# EAGLE schematic ZORRO-LAN-IDE-CP (EAGLE 6.6.0)

## Sheet 1 of 3
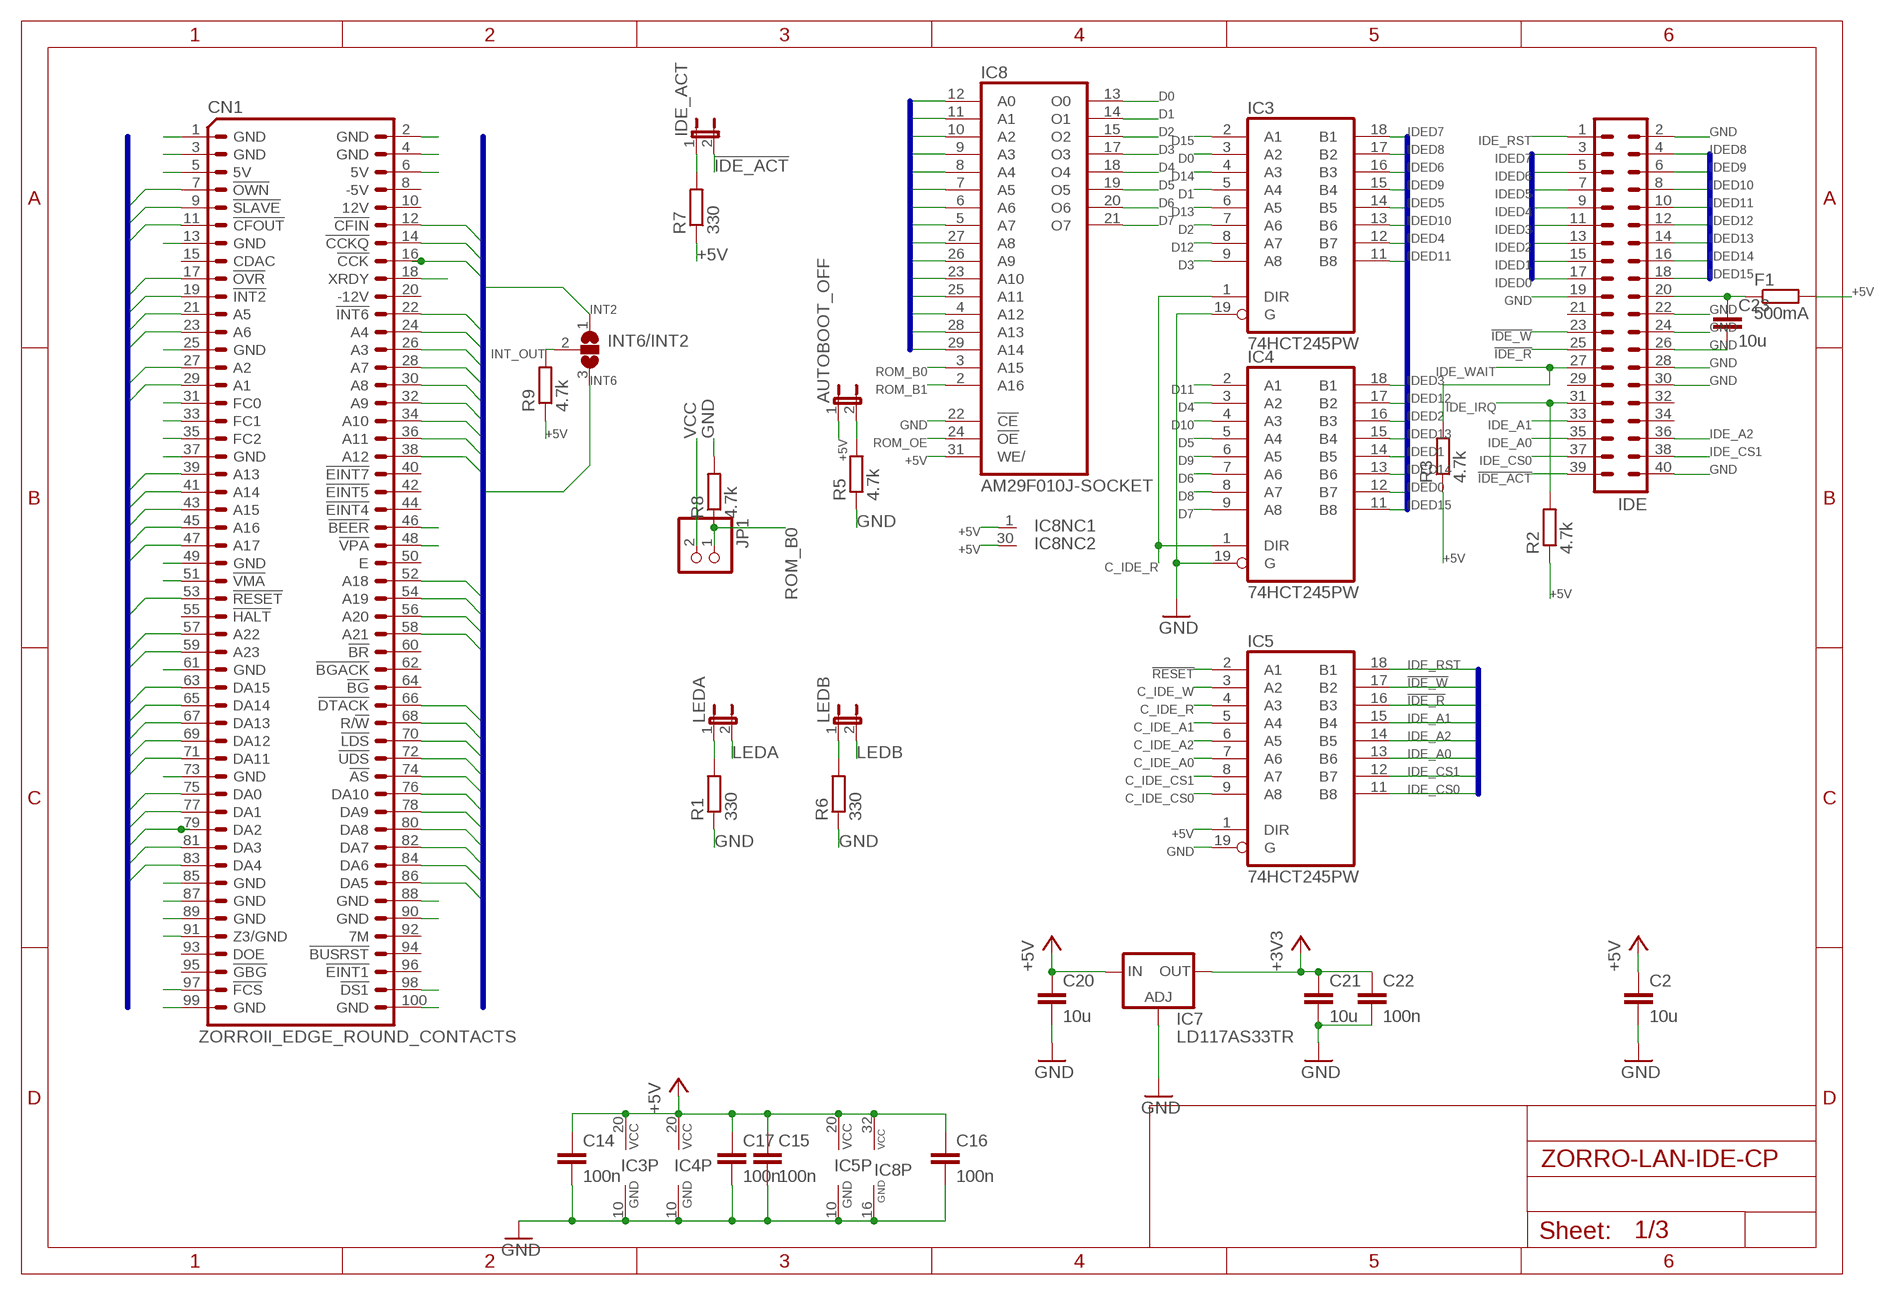
[diagram p0: schematic, sheet 1]

### Parts
AUTOBOOT_OFF  JP1E  [JP1]
C2  10u  C-EUC0805K  [C0805K]
C14  100n  C-EUC0603K  [C0603K]
C15  100n  C-EUC0603K  [C0603K]
C16  100n  C-EUC0603K  [C0603K]
C17  100n  C-EUC0603K  [C0603K]
C20  10u  C-EUC0805K  [C0805K]
C21  10u  C-EUC0805K  [C0805K]
C22  100n  C-EUC0603K  [C0603K]
C23  10u  C-EUC0805K  [C0805K]
CN1  ZORROII_EDGE_ROUND_CONTACTS  [LKONT_50_R]
F1  500mA  R-EU_R2512  [R2512]
IC3  74HCT245PW  [TSSOP20]
IC4  74HCT245PW  [TSSOP20]
IC5  74HCT245PW  [TSSOP20]
IC7  LD117AS33TR  [SOT223]
IC8  AM29F010J-SOCKET  [PLCC-32-SMT-TT]
IDE  ML40  [ML40]
IDE_ACT  JP1E  [JP1]
INT6/INT2  SJ2W  [SJ_2]
JP1  PINHD-1X02_2.54-S  [1X02-S]
LEDA  JP1E  [JP1]
LEDB  JP1E  [JP1]
R1  330  R-EU_R0603  [R0603]
R2  4.7k  R-EU_R0603  [R0603]
R3  4.7k  R-EU_R0603  [R0603]
R5  4.7k  R-EU_R0603  [R0603]
R6  330  R-EU_R0603  [R0603]
R7  330  R-EU_R0603  [R0603]
R8  4.7k  R-EU_R0603  [R0603]
R9  4.7k  R-EU_R0603  [R0603]

### Nets
!AS: CN1.74(!AS!) ; also sheet 2
!BERR: CN1.46(!BEER!) ; also sheet 2
!CFIN: CN1.12(!CFIN!) ; also sheet 2
!CFOUT: CN1.11(!CFOUT!) ; also sheet 2
!DS0: CN1.51(!VMA!) ; also sheet 2
!DS1: CN1.98(!DS1!) ; also sheet 2
!DTACK: CN1.66(!DTACK!) ; also sheet 2
!FCS: CN1.97(!FCS!) ; also sheet 2
!IDE_ACT: IDE.39 IDE_ACT.2
!IDE_R: IC5.16(B3) IDE.25
!IDE_W: IC5.17(B2) IDE.23
!LDS: CN1.70(!LDS!) ; also sheet 2
!MTACK: CN1.48(!VPA!) ; also sheet 2
!MTCR: CN1.18(XRDY) ; also sheet 2
!OVR: CN1.17(!OVR!) ; also sheet 2
!OWN: CN1.7(!OWN!) ; also sheet 2
!RESET: CN1.53(!RESET!) IC5.2(A1) ; also sheet 2
!SLAVE: CN1.9(!SLAVE!) ; also sheet 2
!UDS: CN1.72(!UDS!) ; also sheet 2
+3V3: C21.1 C22.1 IC7.2(OUT) IC7.4(OUT) ; also sheet 2
+5V: AUTOBOOT_OFF.1 C2.1 C14.1 C15.1 C16.1 C17.1 C20.1 CN1.5(5V) CN1.6(5V) F1.2 IC3.20(VCC) IC4.20(VCC) IC5.1(DIR) IC5.20(VCC) IC7.3(IN) IC8.1(NC) IC8.30(NC) IC8.31(WE/) IC8.32(VCC) R2.1 R3.1 R7.1 R9.1 ; also sheet 2,3
A1: CN1.29(A1) IC8.12(A0) ; also sheet 2
A2: CN1.27(A2) IC8.11(A1) ; also sheet 2
A3: CN1.26(A3) IC8.10(A2) ; also sheet 2
A4: CN1.24(A4) IC8.9(A3) ; also sheet 2
A5: CN1.21(A5) IC8.8(A4) ; also sheet 2
A6: CN1.23(A6) IC8.7(A5) ; also sheet 2
A7: CN1.28(A7) IC8.6(A6) ; also sheet 2
A8: CN1.30(A8) IC8.5(A7) ; also sheet 2
A9: CN1.32(A9) IC8.27(A8) ; also sheet 2
A10: CN1.34(A10) IC8.26(A9) ; also sheet 2
A11: CN1.36(A11) IC8.23(A10) ; also sheet 2
A12: CN1.38(A12) IC8.25(A11) ; also sheet 2
A13: CN1.39(A13) IC8.4(A12) ; also sheet 2
A14: CN1.41(A14) IC8.28(A13) ; also sheet 2
A15: CN1.43(A15) IC8.29(A14) ; also sheet 2
A16: CN1.45(A16) ; also sheet 2
A17: CN1.47(A17) ; also sheet 2
A18: CN1.52(A18) ; also sheet 2
A19: CN1.54(A19) ; also sheet 2
A20: CN1.56(A20) ; also sheet 2
A21: CN1.58(A21) ; also sheet 2
A22: CN1.57(A22) ; also sheet 2
A23: CN1.59(A23) ; also sheet 2
AUTO_BOOT_OFF: AUTOBOOT_OFF.2 R5.2 ; also sheet 2
C1: CN1.14(!CCKQ!) ; also sheet 2
C3: CN1.16(!CCK!) ; also sheet 2
C_IDE_A0: IC5.7(A6) ; also sheet 2
C_IDE_A1: IC5.5(A4) ; also sheet 2
C_IDE_A2: IC5.6(A5) ; also sheet 2
C_IDE_CS0: IC5.9(A8) ; also sheet 2
C_IDE_CS1: IC5.8(A7) ; also sheet 2
C_IDE_R: IC3.1(DIR) IC4.1(DIR) IC5.4(A3) ; also sheet 2
C_IDE_W: IC5.3(A2) ; also sheet 2
D0: CN1.75(DA0) IC3.3(A2) IC8.13(O0) ; also sheet 2
D1: CN1.77(DA1) IC3.5(A4) IC8.14(O1) ; also sheet 2
D2: CN1.79(DA2) IC3.7(A6) IC8.15(O2) ; also sheet 2
D3: CN1.81(DA3) IC3.9(A8) IC8.17(O3) ; also sheet 2
D4: CN1.83(DA4) IC4.3(A2) IC8.18(O4) ; also sheet 2
D5: CN1.86(DA5) IC4.5(A4) IC8.19(O5) ; also sheet 2
D6: CN1.84(DA6) IC4.7(A6) IC8.20(O6) ; also sheet 2
D7: CN1.82(DA7) IC4.9(A8) IC8.21(O7) ; also sheet 2
D8: CN1.80(DA8) IC4.8(A7) ; also sheet 2
D9: CN1.78(DA9) IC4.6(A5) ; also sheet 2
D10: CN1.76(DA10) IC4.4(A3) ; also sheet 2
D11: CN1.71(DA11) IC4.2(A1) ; also sheet 2
D12: CN1.69(DA12) IC3.8(A7) ; also sheet 2
D13: CN1.67(DA13) IC3.6(A5) ; also sheet 2
D14: CN1.65(DA14) IC3.4(A3) ; also sheet 2
D15: CN1.63(DA15) IC3.2(A1) ; also sheet 2
FC0: CN1.31(FC0)
FC1: CN1.33(FC1)
FC2: CN1.35(FC2)
GND: C2.2 C14.2 C15.2 C16.2 C17.2 C20.2 C21.2 C22.2 C23.2 CN1.1(GND) CN1.2(GND) CN1.3(GND) CN1.4(GND) CN1.13(GND) CN1.25(GND) CN1.37(GND) CN1.49(GND) CN1.61(GND) CN1.73(GND) CN1.85(GND) CN1.87(GND) CN1.88(GND) CN1.89(GND) CN1.90(GND) CN1.99(GND) CN1.100(GND) IC3.10(GND) IC3.19(G) IC4.10(GND) IC4.19(G) IC5.10(GND) IC5.19(G) IC7.1(ADJ) IC8.16(GND) IC8.22(!CE) IDE.2 IDE.19 IDE.22 IDE.24 IDE.26 IDE.28 IDE.30 IDE.40 R1.1 R5.1 R6.1 R8.2 ; also sheet 2,3
IDE_A0: IC5.13(B6) IDE.35
IDE_A1: IC5.15(B4) IDE.33
IDE_A2: IC5.14(B5) IDE.36
IDE_CS0: IC5.11(B8) IDE.37
IDE_CS1: IC5.12(B7) IDE.38
IDE_IRQ: IDE.31 R2.2
IDE_RST: IC5.18(B1) IDE.1 ; also sheet 3
IDE_WAIT: IDE.27 R3.2 ; also sheet 2
IDED0: IC4.12(B7) IDE.17
IDED1: IC4.14(B5) IDE.15
IDED2: IC4.16(B3) IDE.13
IDED3: IC4.18(B1) IDE.11
IDED4: IC3.12(B7) IDE.9
IDED5: IC3.14(B5) IDE.7
IDED6: IC3.16(B3) IDE.5
IDED7: IC3.18(B1) IDE.3
IDED8: IC3.17(B2) IDE.4
IDED9: IC3.15(B4) IDE.6
IDED10: IC3.13(B6) IDE.8
IDED11: IC3.11(B8) IDE.10
IDED12: IC4.17(B2) IDE.12
IDED13: IC4.15(B4) IDE.14
IDED14: IC4.13(B6) IDE.16
IDED15: IC4.11(B8) IDE.18
INT2: CN1.19(!INT2!) INT6/INT2.1
INT6: CN1.22(!INT6!) INT6/INT2.3
INT_OUT: INT6/INT2.2 R9.2 ; also sheet 2
KEY_PIN_POWER: C23.1 F1.1 IDE.20
LEDA: LEDA.2 ; also sheet 2
LEDB: LEDB.2 ; also sheet 2
N$1: LEDA.1 R1.2
N$2: LEDB.1 R6.2
N$42: IDE_ACT.1 R7.2
R/W: CN1.68(R/!W!) ; also sheet 2
ROM_B0: IC8.3(A15) JP1.1 R8.1 ; also sheet 2
ROM_B1: IC8.2(A16) ; also sheet 2
ROM_OE: IC8.24(!OE) ; also sheet 2
VCC: JP1.2
Z3: CN1.91(Z3/GND) ; also sheet 2
Unconnected: CN1.8(-5V) CN1.10(12V) CN1.15(CDAC) CN1.20(-12V) CN1.40(!EINT7!) CN1.42(!EINT5!) CN1.44(!EINT4!) CN1.50(E) CN1.55(!HALT!) CN1.60(!BR!) CN1.62(!BGACK!) CN1.64(!BG!) CN1.92(7M) CN1.93(DOE) CN1.94(!BUSRST!) CN1.95(!GBG!) CN1.96(!EINT1!) IDE.21 IDE.29 IDE.32 IDE.34

### Buses
IDED[0..15]
IDE_RST,IDE_A[0..2],IDE_CS[0..1],!IDE_R,!IDE_W
A[1..23]
A[1..31],D[0..15],C1,C3,!UDS,!LDS,!RESET,!AS,!DTACK,R/W,!OWN,!SLAVE,!CFIN,!CFOUT,!OVR,INT2,INT6
A[1..23],D[0..15],C1,C3,!UDS,!LDS,!RESET,!AS,!DTACK,R/W,!OWN,!SLAVE,!CFIN,!CFOUT,!OVR,INT2,INT6

## Sheet 2 of 3
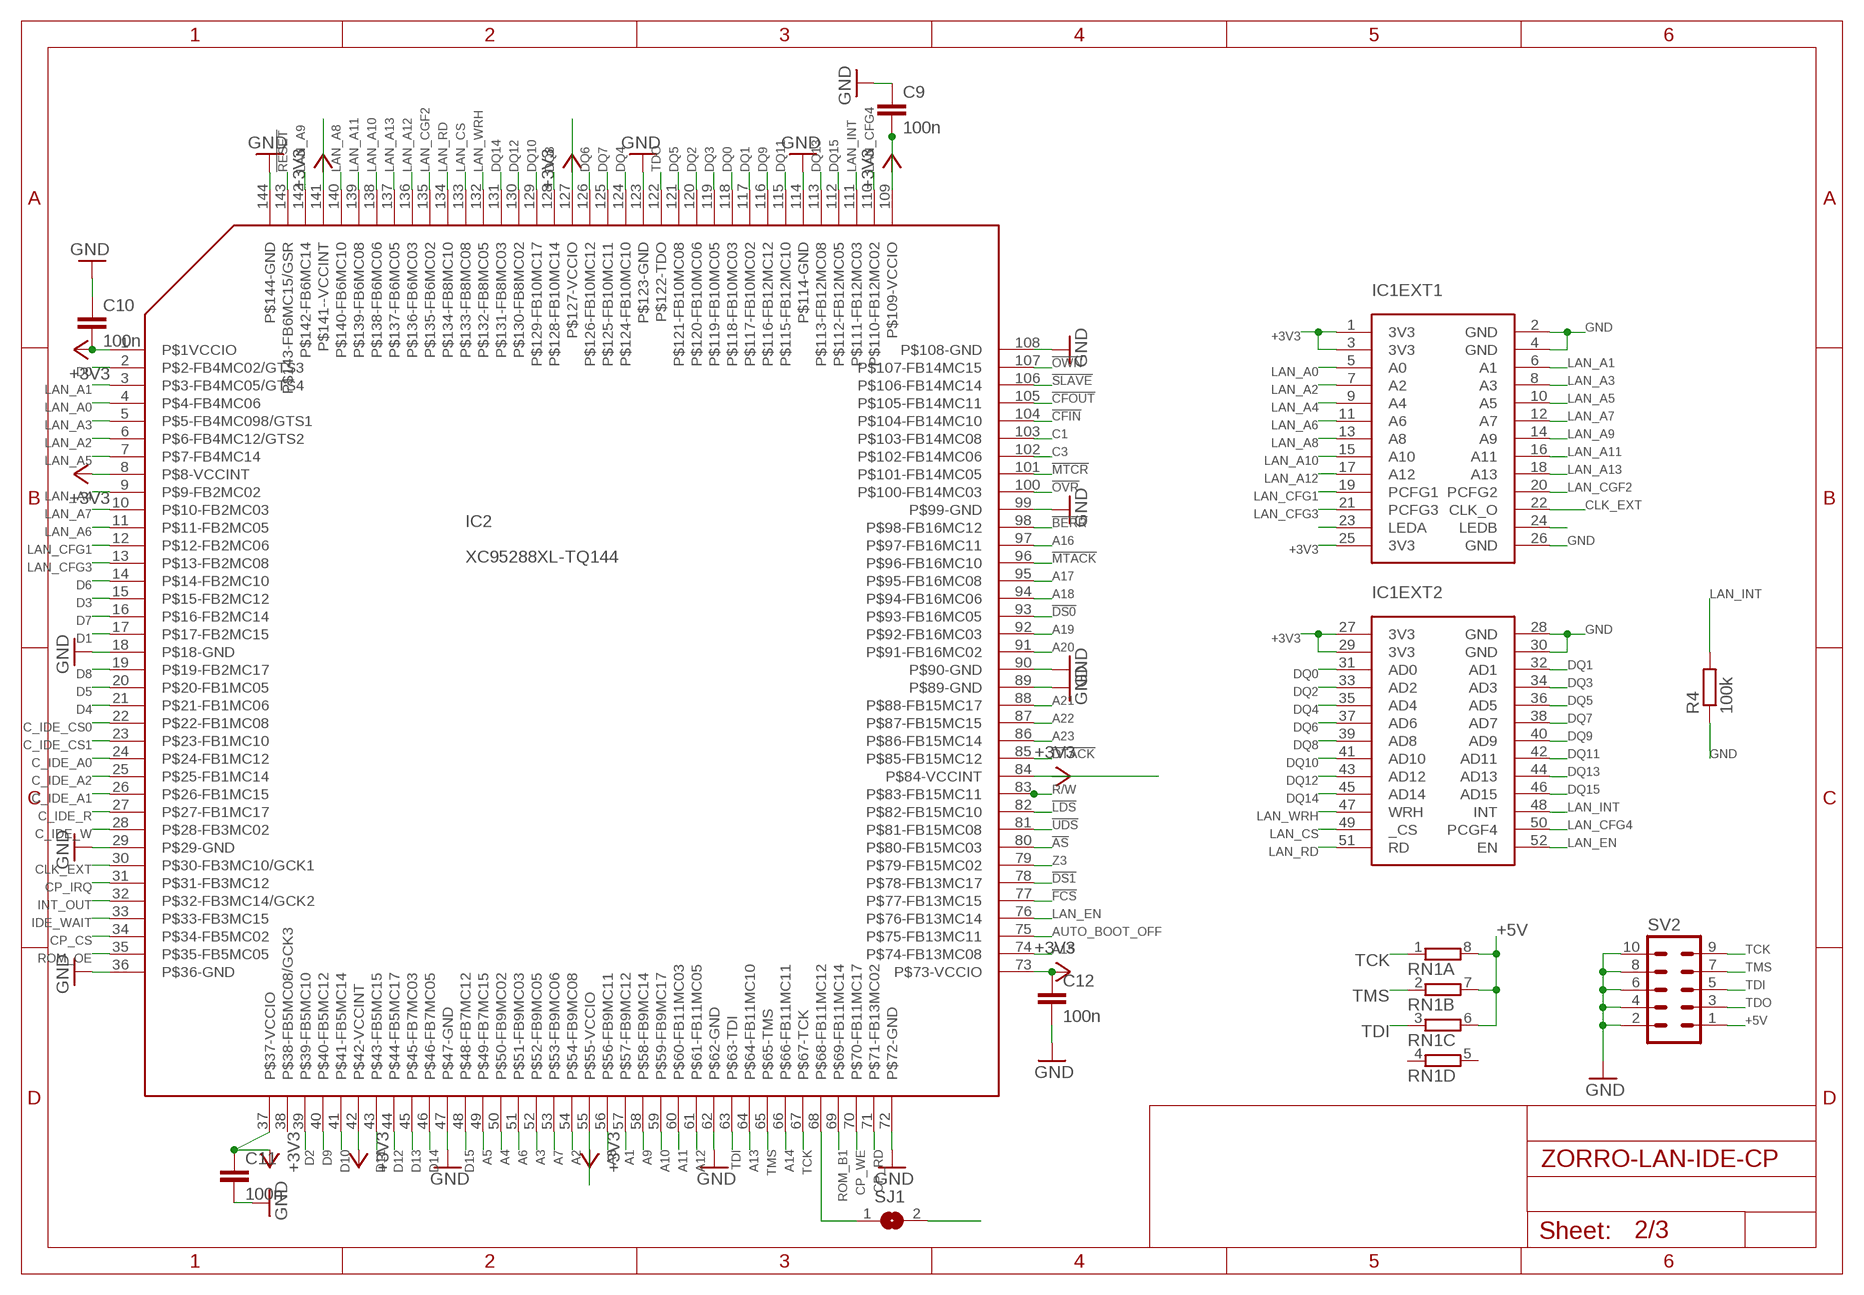
[diagram p1: schematic, sheet 2]

### Parts
C9  100n  C-EUC0603K  [C0603K]
C10  100n  C-EUC0603K  [C0603K]
C11  100n  C-EUC0603K  [C0603K]
C12  100n  C-EUC0603K  [C0603K]
IC1  OLIMEX_ENC  [OLIMEX-ENC624J600]
IC2  XC95288XL-TQ144  [TQFP144]
R4  100k  R-EU_R0603  [R0603]
RN1  4R-NCAY16  [CAY16]
SJ1  SJ  [SJ]
SV2  ML10L  [ML10L]

### Nets
!AS: IC2.80(P$80-FB15MC03) ; also sheet 1
!BERR: IC2.98(P$98-FB16MC12) ; also sheet 1
!CFIN: IC2.104(P$104-FB14MC10) ; also sheet 1
!CFOUT: IC2.105(P$105-FB14MC11) ; also sheet 1
!DS0: IC2.93(P$93-FB16MC05) ; also sheet 1
!DS1: IC2.78(P$78-FB13MC17) ; also sheet 1
!DTACK: IC2.85(P$85-FB15MC12) ; also sheet 1
!FCS: IC2.77(P$77-FB13MC15) ; also sheet 1
!LDS: IC2.82(P$82-FB15MC10) ; also sheet 1
!MTACK: IC2.96(P$96-FB16MC10) ; also sheet 1
!MTCR: IC2.101(P$101-FB14MC05) ; also sheet 1
!OVR: IC2.100(P$100-FB14MC03) ; also sheet 1
!OWN: IC2.107(P$107-FB14MC15) ; also sheet 1
!RESET: IC2.143(P$143-FB6MC15/GSR) ; also sheet 1
!SLAVE: IC2.106(P$106-FB14MC14) ; also sheet 1
!UDS: IC2.81(P$81-FB15MC08) ; also sheet 1
+3V3: C9.2 C10.2 C11.1 C12.1 IC1.1(EXT1:3V3) IC1.3(EXT1:3V3) IC1.25(EXT1:3V3) IC1.27(EXT2:3V3) IC1.29(EXT2:3V3) IC2.1(P$1VCCIO) IC2.8(P$8-VCCINT) IC2.37(P$37-VCCIO) IC2.42(P$42-VCCINT) IC2.55(P$55-VCCIO) IC2.73(P$73-VCCIO) IC2.84(P$84-VCCINT) IC2.109(P$109-VCCIO) IC2.127(P$127-VCCIO) IC2.141(P$141--VCCINT) ; also sheet 1
+5V: RN1.6 RN1.7 RN1.8 SV2.1 ; also sheet 1,3
A1: IC2.57(P$57-FB9MC12) ; also sheet 1
A2: IC2.54(P$54-FB9MC08) ; also sheet 1
A3: IC2.52(P$52-FB9MC05) ; also sheet 1
A4: IC2.50(P$50-FB9MC02) ; also sheet 1
A5: IC2.49(P$49-FB7MC15) ; also sheet 1
A6: IC2.51(P$51-FB9MC03) ; also sheet 1
A7: IC2.53(P$53-FB9MC06) ; also sheet 1
A8: IC2.56(P$56-FB9MC11) ; also sheet 1
A9: IC2.58(P$58-FB9MC14) ; also sheet 1
A10: IC2.59(P$59-FB9MC17) ; also sheet 1
A11: IC2.60(P$60-FB11MC03) ; also sheet 1
A12: IC2.61(P$61-FB11MC05) ; also sheet 1
A13: IC2.64(P$64-FB11MC10) ; also sheet 1
A14: IC2.66(P$66-FB11MC11) ; also sheet 1
A15: IC2.74(P$74-FB13MC08) ; also sheet 1
A16: IC2.97(P$97-FB16MC11) ; also sheet 1
A17: IC2.95(P$95-FB16MC08) ; also sheet 1
A18: IC2.94(P$94-FB16MC06) ; also sheet 1
A19: IC2.92(P$92-FB16MC03) ; also sheet 1
A20: IC2.91(P$91-FB16MC02) ; also sheet 1
A21: IC2.88(P$88-FB15MC17) ; also sheet 1
A22: IC2.87(P$87-FB15MC15) ; also sheet 1
A23: IC2.86(P$86-FB15MC14) ; also sheet 1
AUTO_BOOT_OFF: IC2.75(P$75-FB13MC11) ; also sheet 1
C1: IC2.103(P$103-FB14MC08) ; also sheet 1
C3: IC2.102(P$102-FB14MC06) ; also sheet 1
C_IDE_A0: IC2.24(P$24-FB1MC12) ; also sheet 1
C_IDE_A1: IC2.26(P$26-FB1MC15) ; also sheet 1
C_IDE_A2: IC2.25(P$25-FB1MC14) ; also sheet 1
C_IDE_CS0: IC2.22(P$22-FB1MC08) ; also sheet 1
C_IDE_CS1: IC2.23(P$23-FB1MC10) ; also sheet 1
C_IDE_R: IC2.27(P$27-FB1MC17) ; also sheet 1
C_IDE_W: IC2.28(P$28-FB3MC02) ; also sheet 1
CLK_EXT: IC1.22(EXT1:CLK_O) IC2.30(P$30-FB3MC10/GCK1)
CP_CS: IC2.34(P$34-FB5MC02) ; also sheet 3
CP_IRQ: IC2.31(P$31-FB3MC12) ; also sheet 3
CP_RD: IC2.71(P$71-FB13MC02) ; also sheet 3
CP_WE: IC2.70(P$70-FB11MC17) ; also sheet 3
D0: IC2.2(P$2-FB4MC02/GTS3) ; also sheet 1
D1: IC2.17(P$17-FB2MC15) ; also sheet 1
D2: IC2.39(P$39-FB5MC10) ; also sheet 1
D3: IC2.15(P$15-FB2MC12) ; also sheet 1
D4: IC2.21(P$21-FB1MC06) ; also sheet 1
D5: IC2.20(P$20-FB1MC05) ; also sheet 1
D6: IC2.14(P$14-FB2MC10) ; also sheet 1
D7: IC2.16(P$16-FB2MC14) ; also sheet 1
D8: IC2.19(P$19-FB2MC17) ; also sheet 1
D9: IC2.40(P$40-FB5MC12) ; also sheet 1
D10: IC2.41(P$41-FB5MC14) ; also sheet 1
D11: IC2.43(P$43-FB5MC15) ; also sheet 1
D12: IC2.44(P$44-FB5MC17) ; also sheet 1
D13: IC2.45(P$45-FB7MC03) ; also sheet 1
D14: IC2.46(P$46-FB7MC05) ; also sheet 1
D15: IC2.48(P$48-FB7MC12) ; also sheet 1
DQ0: IC1.31(EXT2:AD0) IC2.118(P$118-FB10MC03) ; also sheet 3
DQ1: IC1.32(EXT2:AD1) IC2.117(P$117-FB10MC02) ; also sheet 3
DQ2: IC1.33(EXT2:AD2) IC2.120(P$120-FB10MC06) ; also sheet 3
DQ3: IC1.34(EXT2:AD3) IC2.119(P$119-FB10MC05) ; also sheet 3
DQ4: IC1.35(EXT2:AD4) IC2.124(P$124-FB10MC10) ; also sheet 3
DQ5: IC1.36(EXT2:AD5) IC2.121(P$121-FB10MC08) ; also sheet 3
DQ6: IC1.37(EXT2:AD6) IC2.126(P$126-FB10MC12) ; also sheet 3
DQ7: IC1.38(EXT2:AD7) IC2.125(P$125-FB10MC11) ; also sheet 3
DQ8: IC1.39(EXT2:AD8) IC2.128(P$128-FB10MC14)
DQ9: IC1.40(EXT2:AD9) IC2.116(P$116-FB12MC12)
DQ10: IC1.41(EXT2:AD10) IC2.129(P$129-FB10MC17)
DQ11: IC1.42(EXT2:AD11) IC2.115(P$115-FB12MC10)
DQ12: IC1.43(EXT2:AD12) IC2.130(P$130-FB8MC02)
DQ13: IC1.44(EXT2:AD13) IC2.113(P$113-FB12MC08)
DQ14: IC1.45(EXT2:AD14) IC2.131(P$131-FB8MC03)
DQ15: IC1.46(EXT2:AD15) IC2.112(P$112-FB12MC05)
GND: C9.1 C10.1 C11.2 C12.2 IC1.2(EXT1:GND) IC1.4(EXT1:GND) IC1.26(EXT1:GND) IC1.28(EXT2:GND) IC1.30(EXT2:GND) IC2.18(P$18-GND) IC2.29(P$29-GND) IC2.36(P$36-GND) IC2.47(P$47-GND) IC2.62(P$62-GND) IC2.72(P$72-GND) IC2.89(P$89-GND) IC2.90(P$90-GND) IC2.99(P$99-GND) IC2.108(P$108-GND) IC2.114(P$114-GND) IC2.123(P$123-GND) IC2.144(P$144-GND) R4.1 SV2.2 SV2.4 SV2.6 SV2.8 SV2.10 ; also sheet 1,3
IDE_WAIT: IC2.33(P$33-FB3MC15) ; also sheet 1
INT_OUT: IC2.32(P$32-FB3MC14/GCK2) ; also sheet 1
LAN_A0: IC1.5(EXT1:A0) IC2.4(P$4-FB4MC06)
LAN_A1: IC1.6(EXT1:A1) IC2.3(P$3-FB4MC05/GTS4)
LAN_A2: IC1.7(EXT1:A2) IC2.6(P$6-FB4MC12/GTS2) ; also sheet 3
LAN_A3: IC1.8(EXT1:A3) IC2.5(P$5-FB4MC098/GTS1) ; also sheet 3
LAN_A4: IC1.9(EXT1:A4) IC2.9(P$9-FB2MC02) ; also sheet 3
LAN_A5: IC1.10(EXT1:A5) IC2.7(P$7-FB4MC14) ; also sheet 3
LAN_A6: IC1.11(EXT1:A6) IC2.11(P$11-FB2MC05)
LAN_A7: IC1.12(EXT1:A7) IC2.10(P$10-FB2MC03)
LAN_A8: IC1.13(EXT1:A8) IC2.140(P$140-FB6MC10)
LAN_A9: IC1.14(EXT1:A9) IC2.142(P$142-FB6MC14)
LAN_A10: IC1.15(EXT1:A10) IC2.138(P$138-FB6MC06)
LAN_A11: IC1.16(EXT1:A11) IC2.139(P$139-FB6MC08)
LAN_A12: IC1.17(EXT1:A12) IC2.136(P$136-FB6MC03)
LAN_A13: IC1.18(EXT1:A13) IC2.137(P$137-FB6MC05)
LAN_CFG1: IC1.19(EXT1:PCFG1) IC2.12(P$12-FB2MC06)
LAN_CFG3: IC1.21(EXT1:PCFG3) IC2.13(P$13-FB2MC08)
LAN_CFG4: IC1.50(EXT2:PCGF4) IC2.110(P$110-FB12MC02)
LAN_CGF2: IC1.20(EXT1:PCFG2) IC2.135(P$135-FB6MC02)
LAN_CS: IC1.49(EXT2:_CS) IC2.133(P$133-FB8MC08)
LAN_EN: IC1.52(EXT2:EN) IC2.76(P$76-FB13MC14)
LAN_INT: IC1.48(EXT2:INT) IC2.111(P$111-FB12MC03) R4.2
LAN_RD: IC1.51(EXT2:RD) IC2.134(P$134-FB8MC10)
LAN_WRH: IC1.47(EXT2:WRH) IC2.132(P$132-FB8MC05)
LEDA: IC1.23(EXT1:LEDA) ; also sheet 1
LEDB: IC1.24(EXT1:LEDB) ; also sheet 1
N$40: IC2.68(P$68-FB11MC12) SJ1.1
R/W: IC2.83(P$83-FB15MC11) ; also sheet 1
ROM_B0: SJ1.2 ; also sheet 1
ROM_B1: IC2.69(P$69-FB11MC14) ; also sheet 1
ROM_OE: IC2.35(P$35-FB5MC05) ; also sheet 1
TCK: IC2.67(P$67-TCK) RN1.1 SV2.9
TDI: IC2.63(P$63-TDI) RN1.3 SV2.5
TDO: IC2.122(P$122-TDO) SV2.3
TMS: IC2.65(P$65-TMS) RN1.2 SV2.7
Z3: IC2.79(P$79-FB15MC02) ; also sheet 1
Unconnected: IC2.38(P$38-FB5MC08/GCK3) RN1.4 RN1.5

## Sheet 3 of 3
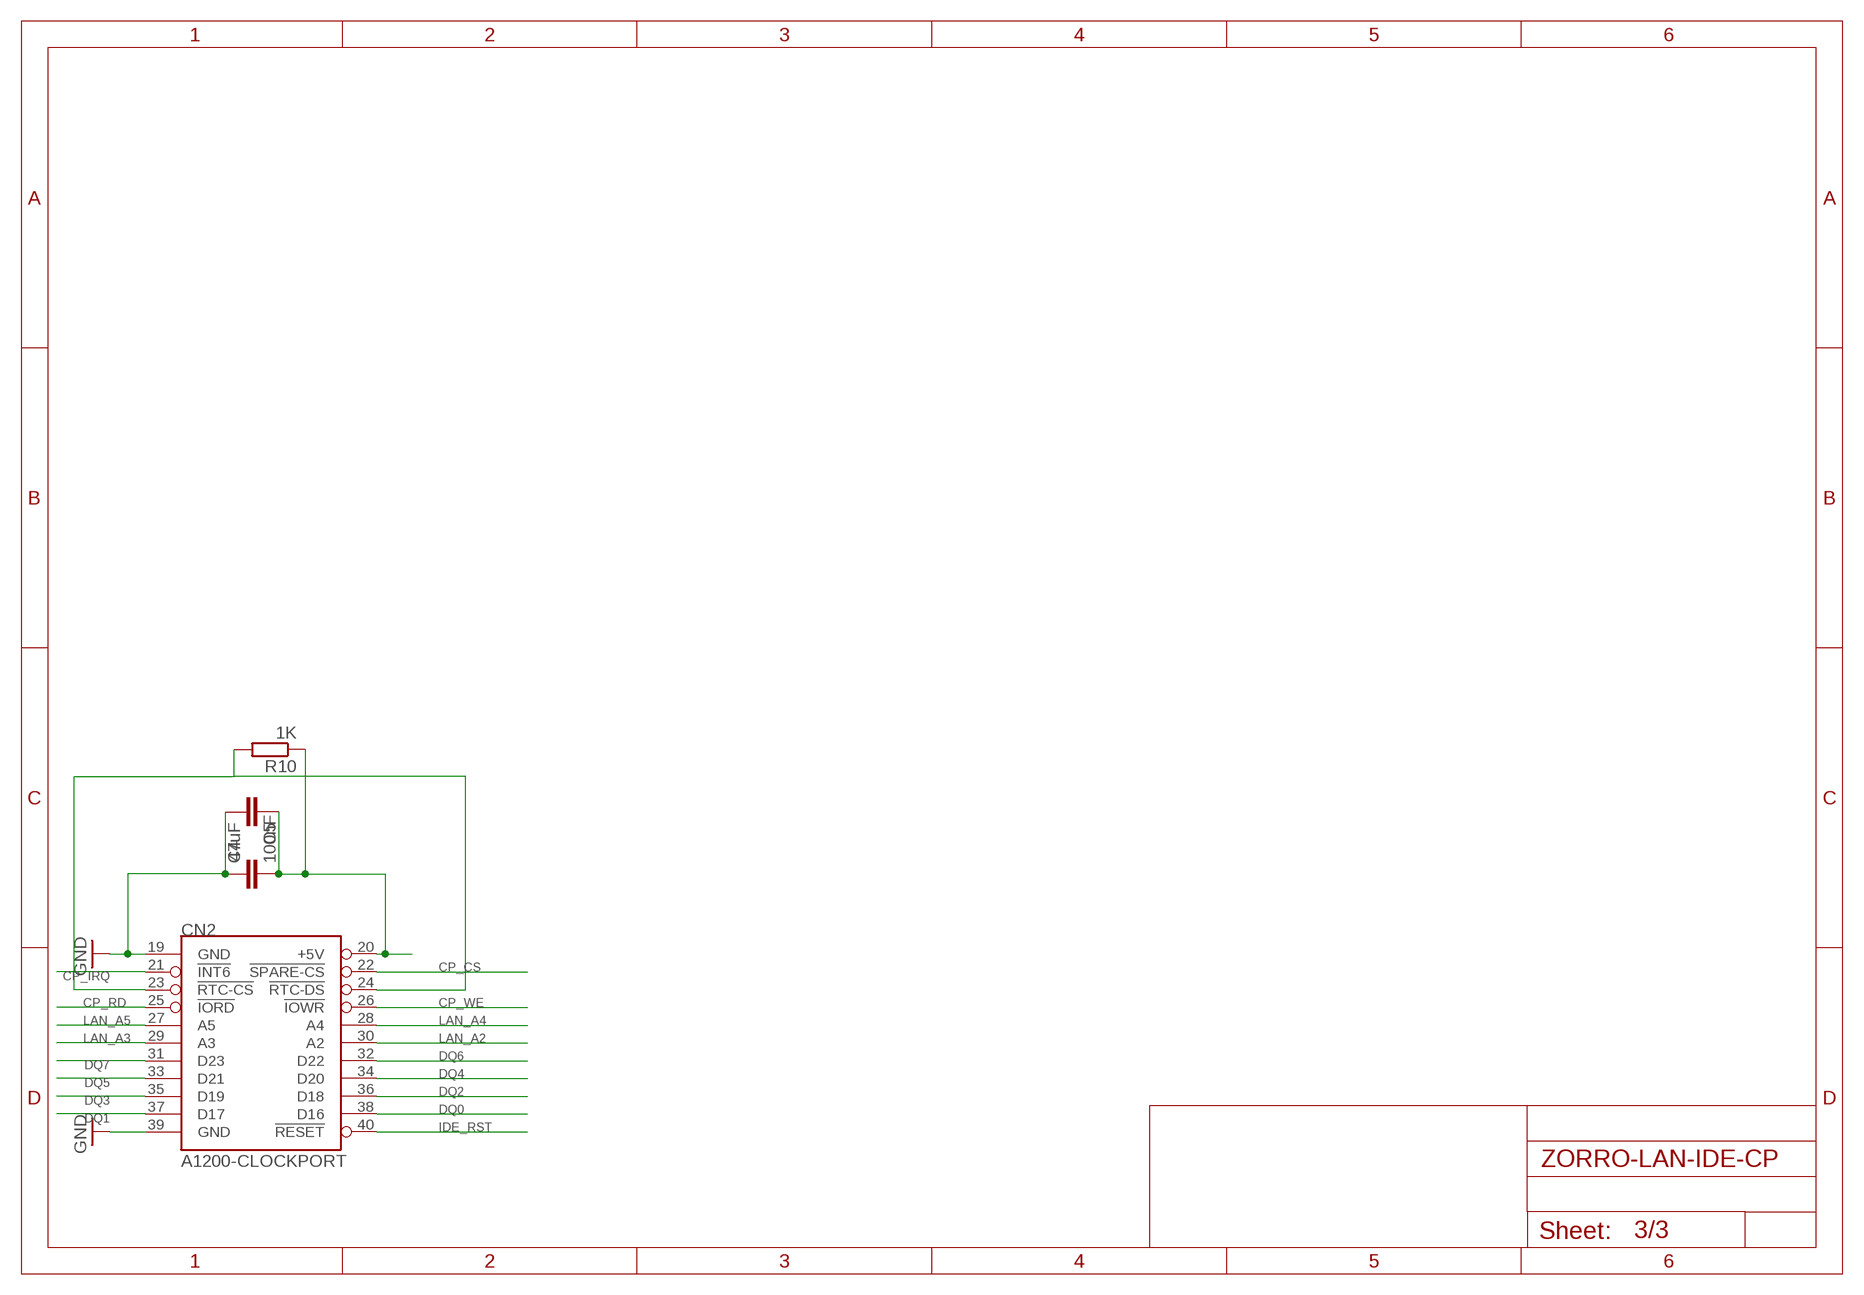
[diagram p2: schematic, sheet 3]

### Parts
C4  100nF  C-EUC0805K  [C0805K]
C5  47uF  C-EUC1206K  [C1206K]
CN2  A1200-CLOCKPORT  [CP-2X11-2.00]
R10  1K  R-EU_R0805  [R0805]

### Nets
+5V: C4.2 C5.1 CN2.20(+5V) R10.1 ; also sheet 1,2
CP_CS: CN2.22(!SPARE-CS) ; also sheet 2
CP_IRQ: CN2.21(!INT6) ; also sheet 2
CP_RD: CN2.25(!IORD) ; also sheet 2
CP_WE: CN2.26(!IOWR) ; also sheet 2
DQ0: CN2.38(D16) ; also sheet 2
DQ1: CN2.37(D17) ; also sheet 2
DQ2: CN2.36(D18) ; also sheet 2
DQ3: CN2.35(D19) ; also sheet 2
DQ4: CN2.34(D20) ; also sheet 2
DQ5: CN2.33(D21) ; also sheet 2
DQ6: CN2.32(D22) ; also sheet 2
DQ7: CN2.31(D23) ; also sheet 2
GND: C4.1 C5.2 CN2.19(GND) CN2.39(GND) ; also sheet 1,2
IDE_RST: CN2.40(!RESET) ; also sheet 1
LAN_A2: CN2.30(A2) ; also sheet 2
LAN_A3: CN2.29(A3) ; also sheet 2
LAN_A4: CN2.28(A4) ; also sheet 2
LAN_A5: CN2.27(A5) ; also sheet 2
N$3: CN2.23(!RTC-CS) CN2.24(!RTC-DS) R10.2

## Library data of the parts
AUTOBOOT_OFF IDE_ACT LEDA LEDB = jumper:JP1E: JUMPER
C2 C4 C5 C9-C12 C14-C17 C20-C23 = rcl:C-EU: CAPACITOR, European symbol
CN1 = Amiga:ZORROII
CN2 = Amiga:A1200-CLOCKPORT
F1 R1-R10 = rcl:R-EU_: RESISTOR, European symbol
IC1 = OLIMEX-ENJ:OLIMEX_ENC
IC2 = xilinx_xc9572xl-tq100:XC95288XL-TQ144
IC3-IC5 = 74xx-eu:74*245: Octal BUS TRANSCEIVER, 3-state
IC7 = v-reg:LD117A?*: Low drop fixed and adjustable positive voltage regulators 1 A Source: http://www.st.com/stonline/products/literature/ds/7194/ld1117axx.pdf
IC8 = am29-memory:AM29F010*: 1-Megabit FLASH MEMORY (128 K x 8 bit) 5 V-only
IDE = con-harting-ml:ML40: HARTING; OC_FARNELL: unknown; OC_NEWARK: unknown
INT6/INT2 = jumper:SJ2W: SMD solder JUMPER
JP1 = pinhead-2:PINHD-1X02: PIN HEADER
RN1 = resistor-dil:4R-N: Array Chip Resistor Source: RS Component / Phycomp; OC_FARNELL: unknown; OC_NEWARK: unknown
SJ1 = jumper:SJ: SMD solder JUMPER
SV2 = con-harting-ml:ML10: HARTING; OC_FARNELL: unknown; OC_NEWARK: unknown

## Net classes
0 default: width 0.152 mm, drill 0.3 mm
1 Power: width 0.305 mm, drill 0.3 mm, clearance 0.102 mm